# Altium schematic sheet 2S_BATTERY_BALANCER_SCH.SchDoc
size 300 x 200 mm
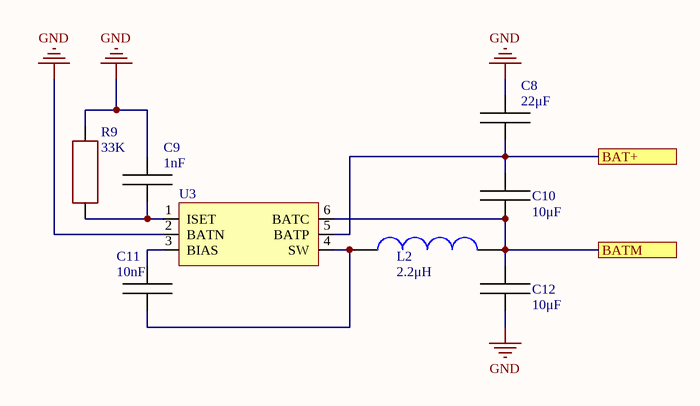
[diagram p0: 2S_BATTERY_BALANCER_SCH.SchDoc]

## Parts
C8  value 22μF  [CAP: 1206]  (hidden comment: Cap_1206)
C9  value 1nF  [CAP: 0402]  (hidden comment: Cap_0402)
C10  value 10μF  [CAP: 0603]  (hidden comment: Cap_0603)
C11  value 10nF  [CAP: 0402]  (hidden comment: Cap_0402)
C12  value 10μF  [CAP: 0603]  (hidden comment: Cap_0603)
L2  value 2.2μH  [CD43]  (hidden comment: CD43)
R9  value 33K  [RES: 0402]
U3  ETA3000  [SOT-23-6]  (value not drawn)

## Ports
BAT+, BATM

## Nets
GND: C8.2 C9.2 C12.2 R9.2 U3.2(BATN)
BAT+: C8.1 C10.1 U3.5(BATP) ; port BAT+
BATM: C10.2 C12.1 L2.1 U3.6(BATC) ; port BATM
NetC9_1: C9.1 R9.1 U3.1(ISET)
NetC11_1: C11.1 L2.2 U3.4(SW)
NetC11_2: C11.2 U3.3(BIAS)

## Library data of the parts
C8 = Cap_1206: TypeDielectric: X7R(X5R); Voltage: ??V; Package/Case: 1206; Temperature: -55...+125°C(-55...+85°C); Product Category: Capacitors
C9 C11 = Cap_0402: TypeDielectric: X7R(X5R); Voltage: ??V; Package/Case: 0402; Temperature: -55...+125°C(-55...+85°C); Product Category: Capacitors
C10 C12 = Cap_0603: TypeDielectric: X7R(X5R); Voltage: ??V; Package/Case: 0603; Temperature: -55...+125°C(-55...+85°C); Product Category: Capacitors
L2 = CD43: SMD Power Inductor; Manufacturer: SUMIDA; Datasheet: https://products.sumida.com/products/pdf/CD43.pdf; HelpURL: https://aliexpress.ru/item/1005002090028747.html?sku_id=12000018707218161&spm=a2g2w.productlist.search_results.13.550c3fc1XziZsU; Product Category: Inductors
R9 = Resistor_0402: Tolerance: ±5%; Product Category: Resistors; Package/Case: 0402; Temperature: -55...+125°C
U3 = ETA3000: Inductive cell balancer; Manufacturer: ETA; Datasheet: https://datasheetspdf.com/mobile/1424958/ETA/ETA3000/1; HelpURL: https://aliexpress.ru/item/1005002742533593.html?sku_id=12000021935942334; Package/Case: SOT-23-6; Product Category: Battery balancers; Value: ETA3000